# EAGLE design midi_switcher_trs (EAGLE 6.6.0)
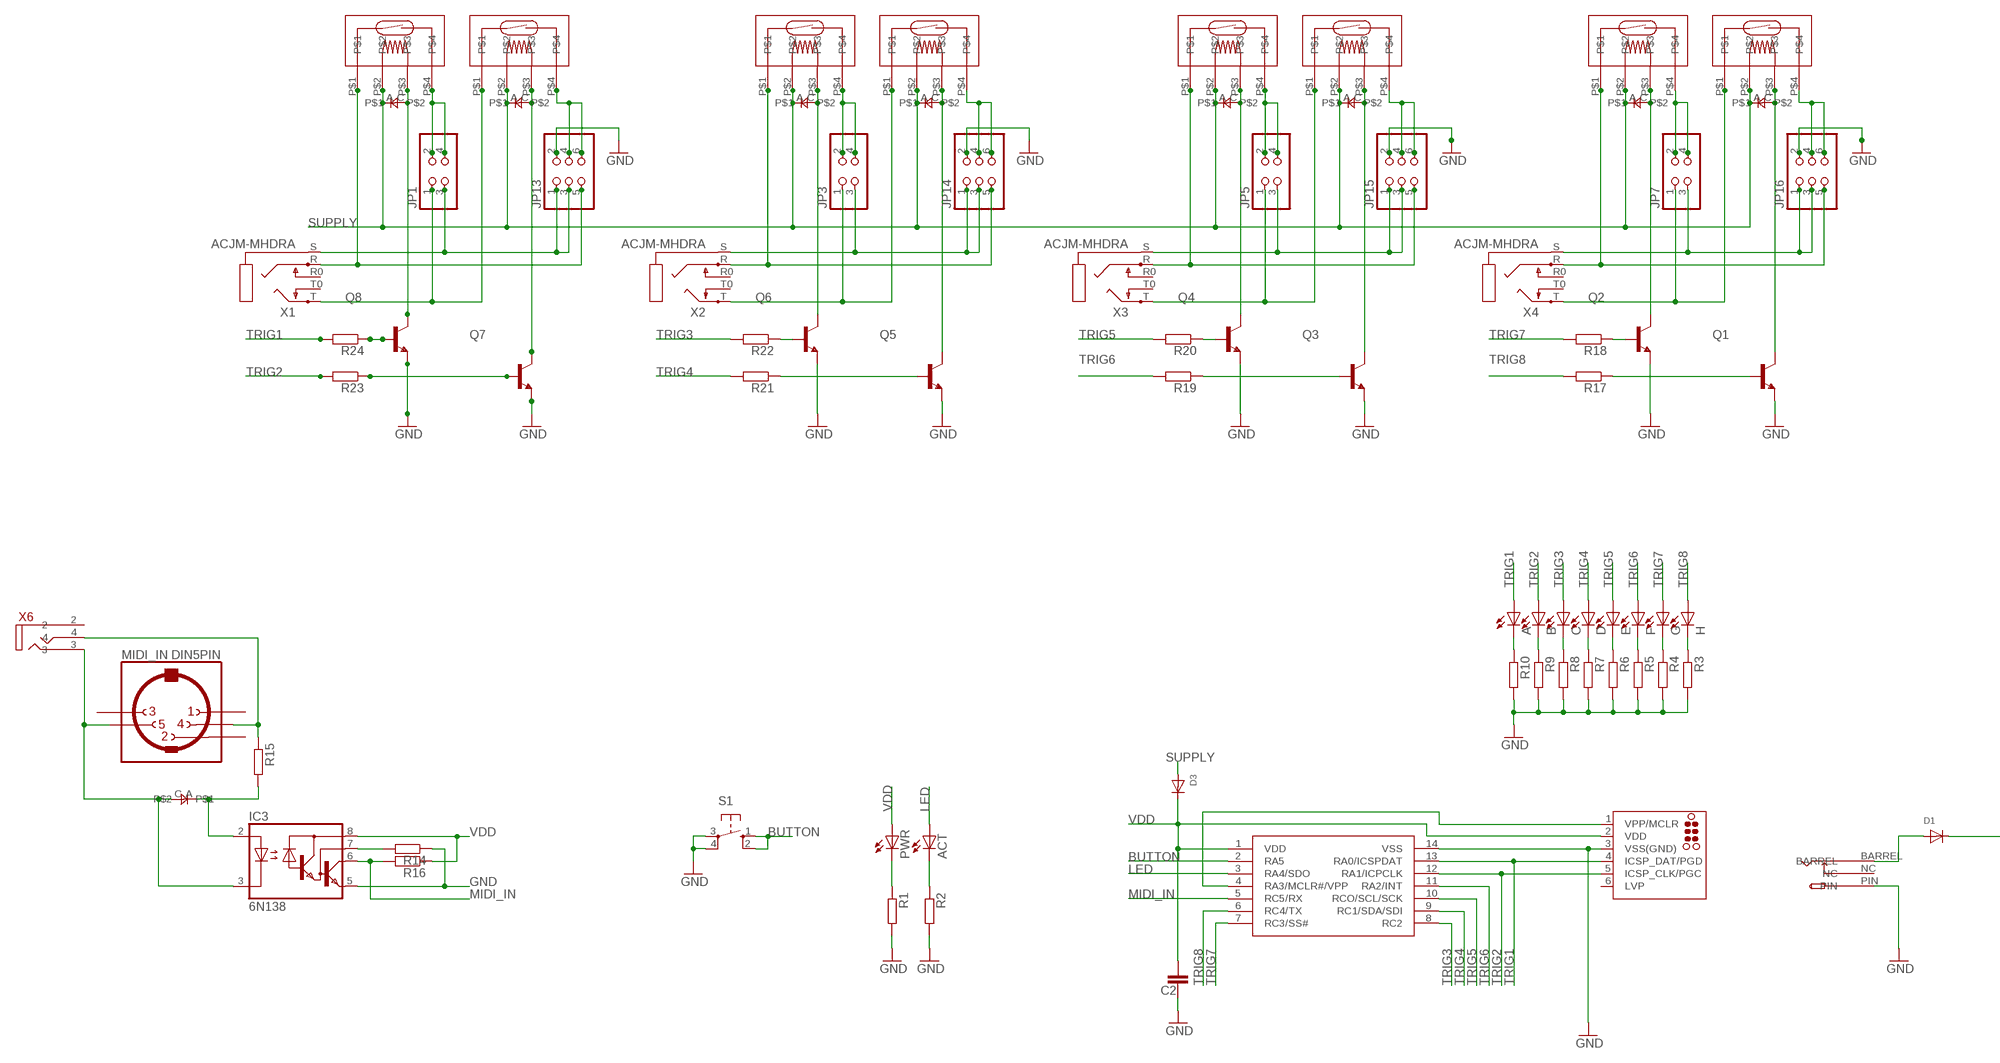
[diagram p0: schematic, sheet 1, part 1 of 2]
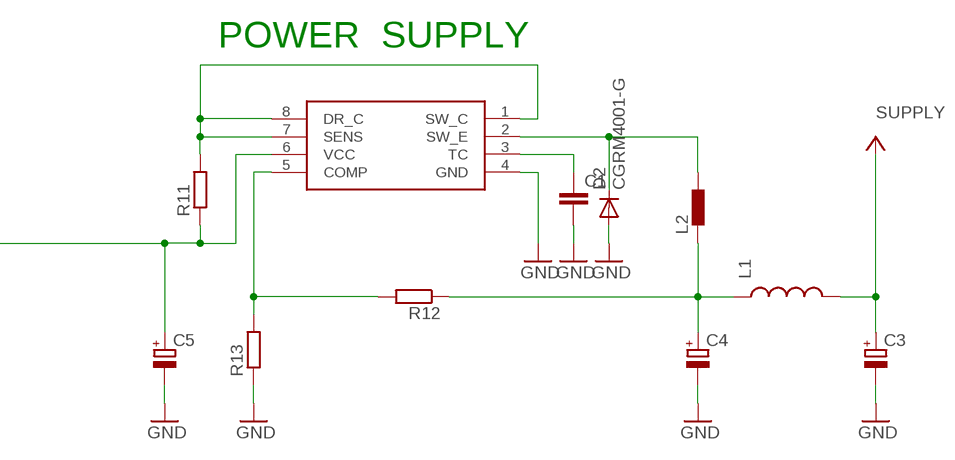
[diagram p1: schematic, sheet 1, part 2 of 2]

## Parts
A  LED3MM  [LED3MM]
ACT  LED3MM  [LED3MM]
B  LED3MM  [LED3MM]
C  LED3MM  [LED3MM]
C1  C-EUC0805  [C0805]
C2  C-EUC0805  [C0805]
C3  CPOL-EUE2.5-7  [E2,5-7]
C4  CPOL-EUE2.5-7  [E2,5-7]
C5  CPOL-EUE2.5-7  [E2,5-7]
D  LED3MM  [LED3MM]
D1  DIODESOD-123  [SOD-123]
D2  CGRM4001-G  [SOD-123_MINI-SMA]
D3  DIODESOD-123  [SOD-123]
D4  0805DIODE  [0805DIODE]
D5  0805DIODE  [0805DIODE]
D6  0805DIODE  [0805DIODE]
D7  0805DIODE  [0805DIODE]
D8  0805DIODE  [0805DIODE]
D9  0805DIODE  [0805DIODE]
D10  0805DIODE  [0805DIODE]
D11  0805DIODE  [0805DIODE]
D12  0805DIODE  [0805DIODE]
E  LED3MM  [LED3MM]
F  LED3MM  [LED3MM]
G  LED3MM  [LED3MM]
H  LED3MM  [LED3MM]
IC1  SP34063A_BOOST_REG  [SOIC8]
IC2  PIC16F1825SO14  [SO14]
IC3  6N138  [DIL08]
ICSP  TC2030-MCP-NL  [TC2030-MCP-NL]
JP1  PINHD-2X2  [2X02]
JP3  PINHD-2X2  [2X02]
JP5  PINHD-2X2  [2X02]
JP7  PINHD-2X2  [2X02]
JP13  PINHD-2X3  [2X03]
JP14  PINHD-2X3  [2X03]
JP15  PINHD-2X3  [2X03]
JP16  PINHD-2X3  [2X03]
L1  INDUCTOR1210  [1210]
L2  DR1030  [DR1030]
MIDI_IN  DIN5PIN  [EDGEDIN]
PWR  LED3MM  [LED3MM]
Q1  MMBT3904LT1-NPN-SOT23-BEC  [SOT23-BEC]
Q2  MMBT3904LT1-NPN-SOT23-BEC  [SOT23-BEC]
Q3  MMBT3904LT1-NPN-SOT23-BEC  [SOT23-BEC]
Q4  MMBT3904LT1-NPN-SOT23-BEC  [SOT23-BEC]
Q5  MMBT3904LT1-NPN-SOT23-BEC  [SOT23-BEC]
Q6  MMBT3904LT1-NPN-SOT23-BEC  [SOT23-BEC]
Q7  MMBT3904LT1-NPN-SOT23-BEC  [SOT23-BEC]
Q8  MMBT3904LT1-NPN-SOT23-BEC  [SOT23-BEC]
R1  R-EU_R0805  [R0805]
R2  R-EU_R0805  [R0805]
R3  R-EU_R0805  [R0805]
R4  R-EU_R0805  [R0805]
R5  R-EU_R0805  [R0805]
R6  R-EU_R0805  [R0805]
R7  R-EU_R0805  [R0805]
R8  R-EU_R0805  [R0805]
R9  R-EU_R0805  [R0805]
R10  R-EU_R0805  [R0805]
R11  R-EU_R0805  [R0805]
R12  R-EU_R0805  [R0805]
R13  R-EU_R0805  [R0805]
R14  R-EU_R0805  [R0805]
R15  R-EU_R0805  [R0805]
R16  R-EU_R0805  [R0805]
R17  R-EU_R0805  [R0805]
R18  R-EU_R0805  [R0805]
R19  R-EU_R0805  [R0805]
R20  R-EU_R0805  [R0805]
R21  R-EU_R0805  [R0805]
R22  R-EU_R0805  [R0805]
R23  R-EU_R0805  [R0805]
R24  R-EU_R0805  [R0805]
RLY1  9007-REED-RELAY  [9007-REED-RELAY]
RLY2  9007-REED-RELAY  [9007-REED-RELAY]
RLY3  9007-REED-RELAY  [9007-REED-RELAY]
RLY4  9007-REED-RELAY  [9007-REED-RELAY]
RLY5  9007-REED-RELAY  [9007-REED-RELAY]
RLY6  9007-REED-RELAY  [9007-REED-RELAY]
RLY7  9007-REED-RELAY  [9007-REED-RELAY]
RLY8  9007-REED-RELAY  [9007-REED-RELAY]
S1  10-XX  [B3F-10XX]
U$9  PWR_SOCKET_2_1MM  [PWR_SOCKET_2_1MM]
X1  ACJM-MHDRA  [ACJM-MHDR]
X2  ACJM-MHDRA  [ACJM-MHDR]
X3  ACJM-MHDRA  [ACJM-MHDR]
X4  ACJM-MHDRA  [ACJM-MHDR]
X6  VERTICAL_3_5MM_SOCKET  [VERTICAL_3_5MM_SOCKET]

## Nets
+9V: C5.+ D1.C IC1.6(VCC) R11.1
BUTTON: IC2.2(RA5) S1.1(S) S1.2(S1)
GND: C1.2 C2.2 C3.- C4.- C5.- D2.A IC1.4(GND) IC2.14(VSS) IC3.5(GND) ICSP.3(VSS(GND)) JP13.2 JP14.2 JP15.2 JP16.2 Q1.E Q2.E Q3.E Q4.E Q5.E Q6.E Q7.E Q8.E R1.2 R2.2 R3.2 R4.2 R5.2 R6.2 R7.2 R8.2 R9.2 R10.2 R13.1 R14.1 S1.3(P) S1.4(P1) U$9.PIN
LED: ACT.A IC2.3(RA4/SDO)
MIDI_IN: IC2.5(RC5/RX) IC3.6(VO) R16.2
N$1: JP1.2 JP1.4 RLY1.P$4
N$2: JP13.4 JP13.6 RLY2.P$4
N$3: JP13.5 RLY1.P$1 X1.R
N$4: JP1.1 RLY2.P$1 X1.T
N$5: JP1.3 JP13.1 JP13.3 X1.S
N$6: D11.C Q7.C RLY2.P$3
N$7: Q8.B R24.1
N$8: Q7.B R23.1
N$9: JP3.2 JP3.4 RLY3.P$4
N$10: D12.C Q8.C RLY1.P$3
N$11: JP14.4 JP14.6 RLY4.P$4
N$12: JP14.5 RLY3.P$1 X2.R
N$13: JP3.1 RLY4.P$1 X2.T
N$14: JP3.3 JP14.1 JP14.3 X2.S
N$15: D10.C Q6.C RLY3.P$3
N$16: D9.C Q5.C RLY4.P$3
N$17: Q6.B R22.1
N$18: Q5.B R21.1
N$19: JP5.2 JP5.4 RLY5.P$4
N$20: JP15.4 JP15.6 RLY6.P$4
N$21: JP15.5 RLY5.P$1 X3.R
N$22: JP5.1 RLY6.P$1 X3.T
N$23: JP5.3 JP15.1 JP15.3 X3.S
N$24: D8.C Q4.C RLY5.P$3
N$25: D7.C Q3.C RLY6.P$3
N$26: Q4.B R20.1
N$27: Q3.B R19.1
N$28: JP16.4 JP16.6 RLY8.P$4
N$29: JP7.2 JP7.4 RLY7.P$4
N$30: JP16.5 RLY7.P$1 X4.R
N$31: JP7.1 RLY8.P$1 X4.T
N$32: JP7.3 JP16.1 JP16.3 X4.S
N$33: D6.C Q2.C RLY7.P$3
N$34: D5.C Q1.C RLY8.P$3
N$35: Q2.B R18.1
N$36: Q1.B R17.1
N$37: D4.C IC3.3(C) MIDI_IN.5 X6.3
N$38: MIDI_IN.4 R15.1 X6.4
N$39: D4.A IC3.2(A) R15.2
N$40: IC3.7(VB) R14.2
N$41: PWR.K(C) R1.1
N$42: D1.A U$9.BARREL
N$44: IC1.1(SW_C) IC1.7(SENS) IC1.8(DR_C) R11.2
N$45: C1.1 IC1.3(TC)
N$46: D2.C IC1.2(SW_E) L2.2
N$47: IC1.5(COMP) R12.2 R13.2
N$48: ACT.K(C) R2.1
N$49: A.K(C) R10.1
N$50: B.K(C) R9.1
N$51: C.K(C) R8.1
N$52: D.K(C) R7.1
N$53: E.K(C) R6.1
N$54: F.K(C) R5.1
N$55: G.K(C) R4.1
N$56: H.K(C) R3.1
N$57: C4.+ L1.1 L2.1 R12.1
SUPPLY: C3.+ D3.A D5.A D6.A D7.A D8.A D9.A D10.A D11.A D12.A L1.2 RLY1.P$2 RLY2.P$2 RLY3.P$2 RLY4.P$2 RLY5.P$2 RLY6.P$2 RLY7.P$2 RLY8.P$2 ; supply symbol labelled +5V
TRIG1: A.A IC2.13(RA0/ICSPDAT) ICSP.4(ICSP_DAT/PGD) R24.2
TRIG2: B.A IC2.12(RA1/ICPCLK) ICSP.5(ICSP_CLK/PGC) R23.2
TRIG3: C.A IC2.8(RC2) R22.2
TRIG4: D.A IC2.9(RC1/SDA/SDI) R21.2
TRIG5: E.A IC2.10(RCO/SCL/SCK) R20.2
TRIG6: F.A IC2.11(RA2/INT) R19.2
TRIG7: G.A IC2.7(RC3/SS#) R18.2
TRIG8: H.A IC2.6(RC4/TX) R17.2
VDD: C2.1 D3.C IC2.1(VDD) IC3.8(VCC) ICSP.2(VDD) PWR.A R16.1
VPP: IC2.4(RA3/MCLR#/VPP) ICSP.1(VPP/MCLR)
Unconnected: ICSP.6(LVP) MIDI_IN.1 MIDI_IN.2 MIDI_IN.3 U$9.NC X1.R0 X1.T0 X2.R0 X2.T0 X3.R0 X3.T0 X4.R0 X4.T0 X6.2

## Notes on the sheet
- POWER  SUPPLY

## Library data of the parts
A ACT B C D E F G H PWR = led:LED: LED OSRAM: - CHIPLED LG R971, LG N971, LY N971, LG Q971, LY Q971, LO R971, LY R971 LH N974, LH R974 LS Q976, LO Q976, LY Q976 LO Q996 - Hyper CHIPLED LW Q18S LB Q993, LB Q99A, LB R99A - SideLED LS A670, LO A670, LY A670, LG A670, LP A670 LB A673, LV A673, LT A673, LW A673 LH A674 LY A675 LS A676, LA A676, LO A676, LY A676, LW A676 LS A679, LY A679, LG A679 - Hyper Micro SIDELED® LS Y876, LA Y876, LO Y876, LY Y876 LT Y87S - SmartLED LW L88C, LW L88S LB L89C, LB L89S, LG L890 LS L89K, LO L89K, LY L89K LS L896, LA L896, LO L896, LY L896 - TOPLED LS T670, LO T670, LY T670, LG T670, LP T670 LSG T670, LSP T670, LSY T670, LOP T670, LYG T670 LG T671, LOG T671, LSG T671 LB T673, LV T673, LT T673, LW T673 LH T674 LS T676, LA T676, LO T676, LY T676, LB T676, LH T676, LSB T676, LW T676 LB T67C, LV T67C, LT T67C, LS T67K, LO T67K, LY T67K, LW E67C LS E67B, LA E67B, LO E67B, LY E67B, LB E67C, LV E67C, LT E67C LW T67C LS T679, LY T679, LG T679 LS T770, LO T770, LY T770, LG T770, LP T770 LB T773, LV T773, LT T773, LW T773 LH T774 LS E675, LA E675, LY E675, LS T675 LS T776, LA T776, LO T776, LY T776, LB T776 LHGB T686 LT T68C, LB T68C - Hyper Mini TOPLED® LB M676 - Mini TOPLED Santana® LG M470 LS M47K, LO M47K, LY M47K Source: http://www.osram.convergy.de LUXEON: - LUMILED® LXK2-PW12-R00, LXK2-PW12-S00, LXK2-PW14-U00, LXK2-PW14-V00 LXK2-PM12-R00, LXK2-PM12-S00, LXK2-PM14-U00 LXK2-PE12-Q00, LXK2-PE12-R00, LXK2-PE12-S00, LXK2-PE14-T00, LXK2-PE14-U00 LXK2-PB12-K00, LXK2-PB12-L00, LXK2-PB12-M00, LXK2-PB14-N00, LXK2-PB14-P00, LXK2-PB14-Q00 LXK2-PR12-L00, LXK2-PR12-M00, LXK2-PR14-Q00, LXK2-PR14-R00 LXK2-PD12-Q00, LXK2-PD12-R00, LXK2-PD12-S00 LXK2-PH12-R00, LXK2-PH12-S00 LXK2-PL12-P00, LXK2-PL12-Q00, LXK2-PL12-R00 Source: www.luxeon.com KINGBRIGHT: KA-3528ASYC Source: www.kingbright.com
C1 C2 = rcl:C-EU: CAPACITOR, European symbol
C3-C5 = rcl:CPOL-EU: POLARIZED CAPACITOR, European symbol
D1 D3 = microbuilder:DIODE: Diode SMADIODE - SMA Surface Mount Package 20V 1A Schottky Diode Digikey (500mV @ 1A, 500uA Vr @ 20V): 641-1014-6-ND 10V 2A Schottky Diode Digikey (350mV @ 2A, 700uA Vr @ 10V): MBRA210LT3 SOD-123 30V 200mA (800mV Vf, 2uA Vr @ 25V) Schottky Diode (very fast switching for boost, etc.) - Digikey: BAT54T1GOSTR-ND 30V 500mA (430mV Vf, 130uA Vr @ 30V) Schottky Diode - Digikey: B0530W-FDICT-ND MBR120 1A 20V (0.34Vf) Schottky Diode - Digikey: MBR120VLSFT1GOSCT-ND SOD-323 10V 570mA (380mV Vf, 3ns) Schottky Diode - Digikey: ZLLS410CT-ND 1N4148WS - 75V 150mA (1V Vf @ 10mA, 4ns) Simple Diode - Digikey: 1N4148WSFSCT-ND, Mouser: 512-1N4148WS SOD-523 BAT54 30V 200mA Schottky (0.8 Vf @ 100mA, 5ns) - Digikey: BAT54XV2CT-ND 30V 30mA Schottky Diode (RB751S-40TE61) - Digikey: RB751S-40TE61CT-ND SOT23-R/W - SOT23 Package (R = Solder Paste/Reflow Ovens, W = Hand-Soldering) BAT54Film 40V 300mA - Digikey: 497-7162-1-ND DO-1N4148 Through Hole Small Current Diode (any model)
D2 = diode:CGRM400*-G: Molded plasitc,JEDEC SOD-123/Mini SMA Source: Comchip CGRM4001-G.pdf
D4-D12 = jasons_stuff:0805DIODE
IC1 = jason_eagle6:SP34063A_BOOST_REG
IC2 = jasons_stuff:PIC16F1825
IC3 = optocoupler:6N138: MOTOROLA OPTO COUPLER; MF: VISHAY/TELEFUNKEN; MPN: 6N138; OC_FARNELL: 9860150; OC_NEWARK: 35K5294
ICSP = tag-connect:TC2030: TAG-CONNECT ICSP Connector Manufacturer: Tag-Connect <http://www.tag-connect.com> Cable for easy In-Circuit Serial Programming. Designed for Microchip ICD2, suitable for many others. Two variants - one "with legs" (for hands-free fit on PCB) and another "without legs" for quick programming. PAD Description 1 MCLR/Vpp 2 Vdd 3 GND 4 PGD (ISPDAT) 5 PGC (ISPCLK) 6 nc (used for LVP) ©2009 ROFA.cz - modified and updated by Robert Darlington ‹rdarlington@gmail.com›
JP1 JP3 JP5 JP7 = pinhead:PINHD-2X2: PIN HEADER
JP13-JP16 = pinhead:PINHD-2X3: PIN HEADER
L1 = SparkFun:INDUCTOR: Inductors Basic Inductor/Choke - 0603 and 1206. Footprints are not proven and vary greatly between part numbers.
L2 = inductors:DR1030: DR1030 Series Low Profile Power Inductors Source: Data sheet <http://www.cooperbussmann.com/pdf/c73e479f-f867-4c64-ae26-9c1f23814163.pdf>
MIDI_IN = jason_eagle6:DIN5PIN: Female CONNECTOR 5 pins 90 deg. with shield, horizontal (DIN 41524)
Q1-Q8 = transistor:*-NPN-: NPN Transistror BF959 corrected 2008.03.06
R1-R24 = rcl:R-EU_: RESISTOR, European symbol
RLY1-RLY8 = jason_eagle6:9007-REED-RELAY
S1 = switch-omron:10-XX: OMRON SWITCH; MPN: B3F-1000; OC_FARNELL: 176432; OC_NEWARK: 36M3542
U$9 = jason_eagle6:PWR_SOCKET_2_1MM
X1-X4 = jason_eagle6:ACJM-MHDRA: MIC/HEADPHONE JACK Stereo jack with two switches. Kycon STX3100, CUI SJ1-3555NG and/or 4UCon 05544
X6 = jason_eagle6:VERTICAL_3_5MM_SOCKET

## Board
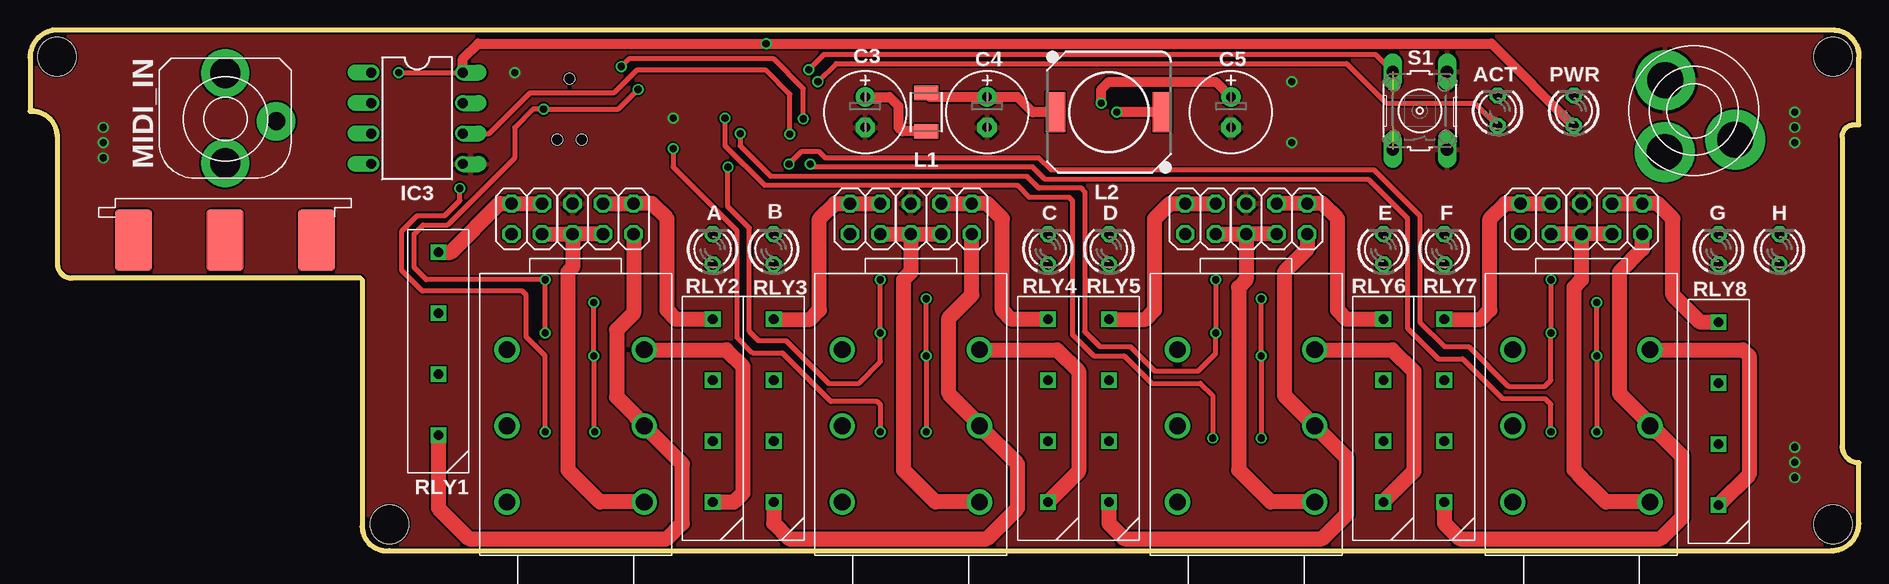
[diagram p2: board, top side]
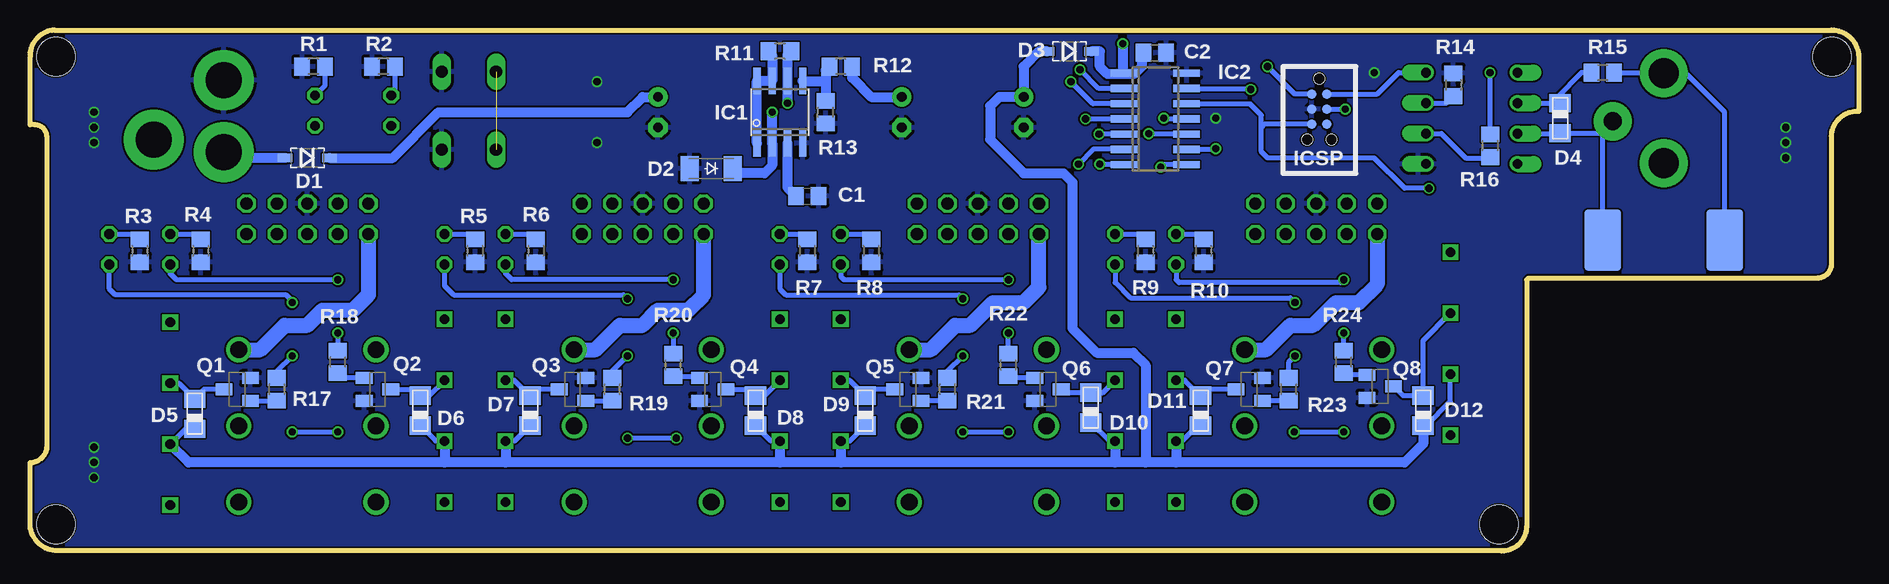
[diagram p3: board, bottom side, seen from below]

Size 152.4 x 43.45 mm. Coordinates in mm from the lower left corner, seen from the top.
Outline: 27.56,22.75 3.48,22.75
Outline: 3.48,22.75 3.43,22.75
Outline: 27.69,22.62 27.69,2.05 arc97 29.97,0.01 150.11,0.01 arc90 152.4,2.3 152.4,7.35 arc-90 151,8.75 151,34.53
Outline: 151,34.56 151,34.53
Outline: 2.29,34.56 2.29,34.53
Outline: 2.29,34.53 2.29,23.94 arc90 3.48,22.75
Outline: 2.29,34.53 arc90 0.15,36.67 0,36.67 0,41.16 arc-90 2.29,43.45 150.37,43.45 arc-90 152.4,41.16 152.4,35.55 152.02,35.55 arc90 151,34.53
Copper layers (1*16): Top 0.035mm / dielectric 1.5mm / Bottom 0.035mm
Design rules "hackvana": minimum track width 6mil, minimum drill 0.3mm, track to track 6mil, track to pad 9mil, pad to pad 6mil, via to via 6mil, smd to smd 0mil, copper to edge 6mil, drill to drill 6mil, minimum pad ring 10mil, minimum via ring 6mil, stop-mask expansion 2mil, vias tented up to drill 100mil, thermal gap 10mil
Holes 3.2 mm at 2.25,41.22 29.97,2.22 150.25,41.22 150.25,2.22

### Footprints (pad centres in the part's own frame; a part is rotated, then mirrored left to right if it is on the bottom)
LED3MM = drill 0.813 octagon: A -1.27,0; K 1.27,0
C0805 = smd 1.3 x 1.5: 1 -0.95,0; 2 0.95,0
E2,5-7 = drill 0.813 pad 1.6: + -1.27,0 | drill 0.813 pad 1.6 octagon: - 1.27,0
SOD-123 = smd 1.2 x 0.7: A 1.85,0; C -1.85,0
SOD-123_MINI-SMA = smd 1.5 x 2.1: A 1.8,0; C -1.8,0
0805DIODE = smd 1.524 x 1.778: A -1.262,-0.005; C 1.238,-0.005
SOIC8 = smd 0.6 x 2.2: 1 -1.905,-2.6; 2 -0.635,-2.6; 3 0.635,-2.6; 4 1.905,-2.6; 5 1.905,2.6; 6 0.635,2.6; 7 -0.635,2.6; 8 -1.905,2.6
SO14 = smd 0.6 x 2.2: 1 -3.81,-2.6; 2 -2.54,-2.6; 3 -1.27,-2.6; 4 0,-2.6; 5 1.27,-2.6; 6 2.54,-2.6; 7 3.81,-2.6; 8 3.81,2.6; 9 2.54,2.6; 10 1.27,2.6; 11 0,2.6; 12 -1.27,2.6; 13 -2.54,2.6; 14 -3.81,2.6
DIL08 = drill 0.813 offset: 1 -3.81,-3.81; 2 -1.27,-3.81; 3 1.27,-3.81; 4 3.81,-3.81; 5 3.81,3.81; 6 1.27,3.81; 7 -1.27,3.81; 8 -3.81,3.81
TC2030-MCP-NL = smd 0.787 x 0.787: 1 1.27,-0.635; 2 1.27,0.635; 3 2.54,-0.635; 4 2.54,0.635; 5 3.81,-0.635; 6 3.81,0.635 | hole 0.889: 0,0; 5.08,-1.016; 5.08,1.016
2X02 = drill 1.016 octagon: 1 -1.27,-1.27; 2 -1.27,1.27; 3 1.27,-1.27; 4 1.27,1.27
2X03 = drill 1.016 octagon: 1 -2.54,-1.27; 2 -2.54,1.27; 3 0,-1.27; 4 0,1.27; 5 2.54,-1.27; 6 2.54,1.27
1210 = smd 1.2 x 2: 1 -1.6,0; 2 1.6,0
DR1030 = smd 3.3 x 1.6: 1 0,4.45; 2 0,-4.45
EDGEDIN = smd 3.048 x 5.08: 1 -7.62,-10.16; 2 0,-10.16; 3 7.62,-10.16 | smd 3.048 x 5.08 bottom: 4 -5.08,-10.16; 5 5.08,-10.16
SOT23-BEC = smd 1 x 1.4: B -0.95,-1.1; C 0,1.1; E 0.95,-1.1
R0805 = smd 1.3 x 1.5: 1 -0.95,0; 2 0.95,0
9007-REED-RELAY = drill 0.8 square: P$1 0,7.62; P$2 0,2.54; P$3 0,-2.54; P$4 0,-7.62
B3F-10XX = drill 1.016 long: 1 -3.251,2.261; 2 3.251,2.261; 3 -3.251,-2.261; 4 3.251,-2.261
PWR_SOCKET_2_1MM = drill 3 pad 5: BARREL 0,4.2; NC -4.2,0; PIN 3.4,-0.7
ACJM-MHDR = drill 1.397: R 0,5.715; R0 0,-5.715; S 6.35,5.715; S0 6.35,-5.715; T -6.35,5.715; T0 -6.35,-5.715
VERTICAL_3_5MM_SOCKET = drill 2.5 pad 4: 2 0,-3.75; 4 0,3.75 | drill 1.5 pad 3.2: 3 4.25,-0.25

### Placement (x,y rotation side)
A  56.9,25.16 90 top
ACT  122.3,36.72 90 top
B  61.98,25.16 90 top
C  84.84,25.16 90 top
C1  87.63,29.6 0 bottom
C2  58.67,41.54 0 bottom
C3  69.6,36.59 270 top
C4  79.76,36.59 270 top
C5  100.08,36.59 270 top
D  89.92,25.16 90 top
D1  129.29,32.78 180 bottom
D2  95.63,31.89 180 bottom
D3  65.79,41.67 180 bottom
D4  24.89,36.08 270 bottom
D5  138.68,11.44 90 bottom
D6  119.89,11.7 90 bottom
D7  110.74,11.7 90 bottom
D8  91.95,11.7 90 bottom
D9  82.8,11.7 90 bottom
D10  64.01,11.95 90 bottom
D11  54.86,11.7 90 bottom
D12  36.32,11.7 90 bottom
E  112.78,25.16 90 top
F  117.86,25.16 90 top
G  140.72,25.16 90 top
H  145.8,25.16 90 top
IC1  89.92,36.59 0 bottom
IC2  58.62,36.03 270 bottom
IC3  32.26,36.08 270 top
ICSP  44.96,39.38 270 bottom
JP1  41.4,27.7 0 top
JP3  69.6,27.7 0 top
JP5  97.54,27.7 0 top
JP7  125.48,27.7 0 top
JP13  47.75,27.7 0 top
JP14  75.95,27.7 0 top
JP15  103.89,27.7 0 top
JP16  131.83,27.7 0 top
L1  74.68,36.59 270 top
L2  89.92,36.59 90 top
MIDI_IN  16.26,36.08 0 top
PWR  128.65,36.72 90 top
Q1  135.13,13.48 90 bottom
Q2  123.44,13.48 270 bottom
Q3  107.19,13.48 90 bottom
Q4  95.5,13.48 270 bottom
Q5  79.25,13.48 90 bottom
Q6  67.56,13.48 270 bottom
Q7  50.8,13.48 90 bottom
Q8  39.88,13.73 270 bottom
R1  128.78,40.4 180 bottom
R2  122.94,40.4 180 bottom
R3  143.26,25.03 270 bottom
R4  138.18,25.03 270 bottom
R5  115.32,25.03 270 bottom
R6  110.24,25.03 270 bottom
R7  87.63,25.03 270 bottom
R8  82.3,25.03 270 bottom
R9  59.44,25.03 270 bottom
R10  54.61,25.03 270 bottom
R11  89.92,41.67 180 bottom
R12  84.84,40.4 180 bottom
R13  86.11,36.59 90 bottom
R14  33.78,38.88 270 bottom
R15  21.34,39.89 180 bottom
R16  30.73,33.8 270 bottom
R17  131.83,13.48 90 bottom
R18  126.75,15.76 90 bottom
R19  103.89,13.48 90 bottom
R20  98.81,15.51 90 bottom
R21  75.95,13.48 90 bottom
R22  70.87,15.51 90 bottom
R23  47.5,13.48 90 bottom
R24  42.93,15.76 90 bottom
RLY1  34.04,17.29 180 top
RLY2  56.9,11.7 180 top
RLY3  61.98,11.7 180 top
RLY4  84.84,11.7 180 top
RLY5  89.92,11.7 180 top
RLY6  112.78,11.7 180 top
RLY7  117.86,11.7 180 top
RLY8  140.72,11.44 180 top
S1  115.82,36.72 90 top
U$9  138.65,36.72 145 top
X1  45.47,10.43 270 top
X2  73.41,10.43 270 top
X3  101.35,10.43 270 top
X4  129.29,10.43 270 top
X6  16.26,36.08 0 top

### Tracks (layer width: path | path; a pad name or v marks a point on that pad's centre or on a via)
+9V  (via drill 0.6)
  Top 0.813: v89.28,37.35 89.28,38.49 89.92,39.13 98.81,39.13 C5.+
  Bottom 0.406: 89.28,41.35 R11.1
  Bottom 0.813: v89.28,37.35 IC1.6 89.28,41.35 | D1.C 122.17,32.78 118.36,36.59 102.62,36.59 101.35,37.86 C5.+
BUTTON  (via drill 0.6)  (1 unrouted)
  Top 0.406: v64.9,40.15 66.17,41.42 112.12,41.42 S1.2
  Bottom 0.406: IC2.2 63.32,38.57 v64.9,40.15
GND  (via drill 0.6)
  other vias: 147.07,7.38 147.07,8.65 147.07,6.11 147.07,36.59 147.07,35.32 147.07,34.05 105.16,39.13 105.16,34.05 6.1,35.32 6.1,34.05 6.1,32.78 53.59,36.08 40.39,39.89
  pour Bottom: -5.33,50.56 -5.33,-4.05 157.23,-4.05 157.23,54.37 -5.33,54.37
  pour Top: -7.87,48.02 -7.87,-6.59 158.5,-6.59 158.5,53.1 -7.87,53.1
LED  (via drill 0.6)
  Top 0.406: v65.66,39.13 67.18,40.65 109.73,40.65 113.03,37.35 120.4,37.35 ACT.A
  Bottom 0.406: IC2.3 63.83,37.3 v65.66,39.13
MIDI_IN  (via drill 0.6)
  Top 0.406: IC3.6 38.29,34.81 41.66,38.18 48.64,38.18 50.55,40.08 61.34,40.08 63.32,38.1 v63.32,34.76
  Bottom 0.406: IC3.6 34.8,34.81 32.77,32.78 30.8,32.78 R16.2 | IC2.5 v63.32,34.76
N$1
  Top 1.27: RLY1.P$4 35.05,24.91 39.12,28.97 JP1.2 JP1.4
N$2
  Top 1.27: JP13.4 JP13.6 | 50.55,28.97 JP13.6 | RLY2.P$4 53.85,19.32 53.09,20.08 53.09,27.7 51.82,28.97 JP13.6
N$3
  Top 1.27: RLY1.P$1 34.04,3.57 36.58,1.03 53.09,1.03 54.36,2.3 54.36,7.25 51.75,9.86 X1.R | X1.R 51.18,10.55 | JP13.5 50.29,19.83 48.9,18.43 48.9,12.84 50.55,11.19 50.55,11.06 X1.R
N$4
  Top 1.27: RLY2.P$1 58.67,4.08 59.44,4.84 59.44,15.38 58.04,16.78 X1.T
  Bottom 1.27: X1.T 49.4,16.78 47.37,18.81 45.47,18.81 43.56,20.71 41.66,20.71 40.13,22.24 JP1.1
N$5
  Top 1.27: X1.S 47.5,4.08 44.83,6.74 44.83,23.25 45.21,23.64 JP13.1 | JP1.3 JP13.1 | JP13.3 JP13.1
N$6
  Bottom 0.406: Q7.C 54.32,13.48 D11.C 56.16,14.24 RLY2.P$3
N$7
  Bottom 0.406: Q8.B 42.79,14.68 R24.1
N$8
  Bottom 0.406: R23.1 Q7.B
N$9
  Top 1.27: RLY3.P$4 65.02,19.32 65.79,20.08 65.79,27.7 67.06,28.97 JP3.2 JP3.4
N$10
  Bottom 0.406: Q8.C 37.98,12.94 D12.C 36.32,17.54 RLY1.P$3
N$11
  Top 1.27: RLY4.P$4 81.79,19.32 81.03,20.08 81.03,27.7 79.76,28.97 JP14.6 JP14.4
N$12
  Top 1.27: RLY3.P$1 61.98,2.3 63.25,1.03 79.76,1.03 82.3,3.57 82.3,7.25 X2.R 79.12,10.55 76.58,13.09 76.58,19.44 78.49,21.35 JP14.5 78.49,25.16
N$13
  Top 1.27: X2.T 85.6,16.78 87.38,15 87.38,6.62 RLY4.P$1
  Bottom 1.27: X2.T 77.34,16.78 75.31,18.81 74.04,18.81 72.14,20.71 69.6,20.71 68.33,21.98 JP3.1
N$14
  Top 1.27: X2.S 75.44,4.08 72.77,6.74 72.77,22.62 73.41,23.25 JP14.1 | JP3.3 JP14.1 | JP14.1 JP14.3
N$15
  Bottom 0.406: RLY3.P$3 63.02,13.19 D10.C 66.18,13.19 Q6.C
N$16
  Bottom 0.406: Q5.C 82.26,13.48 D9.C 84.1,14.24 RLY4.P$3
N$17
  Bottom 0.406: Q6.B 70.73,14.43 R22.1
N$18
  Bottom 0.406: R21.1 Q5.B
N$19
  Top 1.27: RLY5.P$4 92.96,19.32 93.73,20.08 93.73,27.7 95,28.97 JP5.2 JP5.4
N$20
  Top 1.27: RLY6.P$4 109.73,19.32 108.97,20.08 108.97,27.7 107.7,28.97 JP15.6 JP15.4
N$21
  Top 1.27: RLY5.P$1 89.92,2.3 91.19,1.03 107.7,1.03 109.73,3.06 109.73,7.76 X3.R | X3.R 107.06,10.55 | JP15.5 106.43,25.16 104.52,23.25 104.52,12.97 X3.R
N$22
  Top 1.27: X3.T 113.54,16.78 115.32,15 115.32,6.62 RLY6.P$1
  Bottom 1.27: JP5.1 96.27,21.35 97.54,20.08 100.08,20.08 101.35,18.81 103.25,18.81 105.28,16.78 X3.T
N$23
  Top 1.27: X3.S 103.38,4.08 100.71,6.74 100.71,21.98 101.35,22.62 JP15.1 | JP5.3 JP15.1 | JP15.3 JP15.1
N$24
  Bottom 0.406: Q4.C 92.48,13.48 D8.C 91.22,12.94 RLY5.P$3
N$25
  Bottom 0.406: RLY6.P$3 112.04,14.24 D7.C 110.2,13.48 Q3.C
N$26
  Bottom 0.406: R20.1 96.74,14.56 Q4.B
N$27
  Bottom 0.406: Q3.B R19.1
N$28
  Top 1.27: JP16.4 JP16.6 135.64,28.97 136.91,27.7 136.91,21.35 139.19,19.06 RLY8.P$4
N$29
  Top 1.27: RLY7.P$4 120.9,19.32 121.67,20.08 121.67,27.7 122.94,28.97 JP7.2 JP7.4
N$30
  Top 1.27: RLY7.P$1 117.86,2.3 119.13,1.03 135.89,1.03 137.67,2.81 137.67,7.89 135.64,9.92 135.51,9.92 X4.R 135,10.55 132.46,13.09 132.46,23.25 134.37,25.16 JP16.5
N$31
  Top 1.27: X4.T 142.75,16.78 143.26,16.27 143.26,6.36 RLY8.P$1
  Bottom 1.27: JP7.1 124.21,21.35 125.48,20.08 128.02,20.08 129.29,18.81 131.19,18.81 133.22,16.78 X4.T
N$32
  Top 1.27: X4.S 131.32,4.08 129.92,5.47 129.29,6.11 128.65,6.74 128.65,21.98 129.29,22.62 JP16.1 | JP16.3 JP16.1 | JP16.1 JP7.3
N$33
  Bottom 0.406: RLY7.P$3 119.16,12.94 D6.C 120.42,13.48 Q2.C
N$34
  Bottom 0.406: Q1.C 137.89,13.48 D5.C 139.98,13.98 RLY8.P$3
N$35
  Bottom 0.406: Q2.B 126.36,14.43 R18.1
N$36
  Bottom 0.406: Q1.B R17.1
N$37
  Bottom 0.406: IC3.3 24.93,34.81 D4.C 21.49,34.84 21.34,35 | X6.3 21.18,35.16 21.34,35 | MIDI_IN.5 21.34,35
N$38
  Bottom 0.406: MIDI_IN.4 11.18,36.59 14.42,39.83 X6.4 20.33,39.83 R15.1
N$39
  Bottom 0.406: R15.2 23.11,39.89 25.15,37.86 25.15,37.59 D4.A 24.9,37.35 IC3.2
N$40
  Bottom 0.406: IC3.7 34.36,37.35 R14.2
N$41
  Bottom 0.406: R1.1 127.83,38.81 PWR.K
N$42
  Bottom 0.813: D1.A 135.75,32.78 U$9.BARREL
N$44
  Bottom 0.406: 90.55,41.35 R11.2
  Bottom 0.813: IC1.1 IC1.8 IC1.7 90.55,41.35
N$45
  Bottom 0.813: IC1.3 89.28,30.31 C1.1
N$46  (via drill 0.6)
  Top 0.813: L2.2 v90.55,36.59
  Bottom 0.813: v90.55,36.59 IC1.2 90.55,32.14 91.19,31.51 93.45,31.51 D2.C
N$47
  Bottom 0.406: 86.11,40.08 R12.2
  Bottom 0.813: 86.11,40.08 86.11,39.13 | 86.11,39.13 R13.2 | IC1.5 86.17,39.19 86.11,39.13
N$48
  Bottom 0.406: R2.1 121.99,38.3 ACT.K
N$49
  Bottom 0.406: A.K 55.06,26.43 R10.1
N$50
  Bottom 0.406: B.K 59.88,26.43 R9.1
N$51
  Bottom 0.406: C.K 82.3,26.43 R8.1
N$52
  Bottom 0.406: D.K 88.08,26.43 R7.1
N$53
  Bottom 0.406: E.K 110.68,26.43 R6.1
N$54
  Bottom 0.406: F.K 115.76,26.43 R5.1
N$55
  Bottom 0.406: G.K 138.62,26.43 R4.1
N$56
  Bottom 0.406: H.K 143.7,26.43 R3.1
N$57
  Top 0.813: L2.1 83.57,36.59 82.3,37.86 C4.+ 75.01,37.86 L1.1
  Bottom 0.813: R12.1 83.89,39.45 82.3,37.86 C4.+
SUPPLY
  Top 0.813: L1.2 72.72,34.99 72.39,35.32 72.39,37.1 71.63,37.86 C3.+
  Bottom 0.406: RLY2.P$2 56.39,9.16 55.63,9.92 55.38,9.92 D11.A | RLY3.P$2 62.47,9.16 D10.A | RLY4.P$2 84.08,9.16 D9.A | RLY5.P$2 90.66,9.16 D8.A | RLY6.P$2 112.02,9.16 D7.A | RLY7.P$2 118.6,9.16 D6.A | D12.A 36.06,10.44 34.04,12.46 RLY1.P$2 | D5.A 139.44,10.18 RLY8.P$2
  Bottom 0.813: D12.A 36.32,8.91 37.85,7.38 56.9,7.38 | 56.9,7.38 59.44,7.38 | 59.44,7.38 61.98,7.38 | 61.98,7.38 84.84,7.38 | 84.84,7.38 89.92,7.38 | 89.92,7.38 112.78,7.38 | 112.78,7.38 117.86,7.38 | 117.86,7.38 139.19,7.38 RLY8.P$2 | RLY7.P$2 117.86,7.38 | RLY6.P$2 112.78,7.38 | RLY5.P$2 89.92,7.38 | RLY4.P$2 84.84,7.38 | RLY3.P$2 61.98,7.38 | RLY2.P$2 56.9,7.38 | D3.A 68.33,41.67 69.6,40.4 C3.+ 71.63,37.86 72.39,37.1 72.39,34.3 69.6,31.51 66.29,31.51 65.53,30.75 65.53,18.56 63.5,16.52 60.45,16.52 59.44,15.51 59.44,7.38
TRIG1  (via drill 0.6)
  Top 0.406: v50.67,38.49 49.02,36.84 v42.8,36.84 41.91,36.84 40.39,35.32 40.39,32.78 34.8,27.19 32.77,27.19 32,26.43 32,23.64 33.02,22.62 v42.93,22.62 v42.93,18.17
  Bottom 0.406: ICSP.4 v42.8,36.84 | IC2.13 50.75,38.57 v50.67,38.49 | R24.2 v42.93,18.17 | A.A 56.9,22.62 56.64,22.37 43.18,22.37 v42.93,22.62
TRIG2  (via drill 0.6)
  Top 0.406: v46.99,20.71 v46.99,16.27 46.99,9.98 v47.05,9.92 | v42.93,9.92 42.93,16.27 41.34,17.86 41.34,21.35 41.02,21.67 32.7,21.67 30.99,23.38 30.99,26.68 32.26,27.95 34.54,27.95 35.81,29.22 v35.81,30.24
  Bottom 0.406: ICSP.5 49.53,35.57 49.78,35.32 | IC2.12 50.75,37.3 49.78,36.34 49.78,35.32 | R23.2 47.5,15.76 v46.99,16.27 | v35.81,30.24 37.85,30.24 40.39,32.78 49.28,32.78 49.78,33.29 49.78,35.32 | v47.05,9.92 v42.93,9.92 | B.A 61.98,22.37 60.71,21.1 47.37,21.1 v46.99,20.71
TRIG3  (via drill 0.6)
  Top 0.406: v70.87,22.62 v70.87,18.17 70.87,15.76 69.09,13.98 66.55,13.98 62.99,17.54 60.71,17.54 59.94,18.3 59.94,26.94 58.17,28.72 v58.17,32.02
  Bottom 0.406: R22.2 v70.87,18.17 | IC2.8 57.96,32.22 v58.17,32.02 | C.A 84.84,22.87 84.58,22.62 v70.87,22.62
TRIG4  (via drill 0.6)
  Top 0.406: v74.68,21.03 v74.68,16.27 v74.68,9.92 | v53.59,33.54 53.59,32.02 58.93,26.68 58.93,17.79 60.2,16.52 62.67,16.52 66.74,12.46 70.61,12.46 70.87,12.21 v70.87,9.92
  Bottom 0.406: R21.2 75.95,15 v74.68,16.27 | v74.68,21.03 74.99,21.35 89.41,21.35 89.92,21.86 D.A | v74.68,9.92 v70.87,9.92 | IC2.9 53.65,33.49 v53.59,33.54
TRIG5  (via drill 0.6)
  Top 0.406: v98.81,22.62 v98.81,18.17 R20.2 97.35,15 93.73,15 91.69,17.03 89.15,17.03 87.88,18.3 87.88,29.99 87.63,30.24 84.07,30.24 83.06,31.26 61.72,31.26 59.18,33.8 v59.18,34.81
  Bottom 0.406: v98.81,18.17 R20.2 | IC2.10 59.13,34.76 v59.18,34.81 | v98.81,22.62 112.27,22.62 112.78,23.13 E.A
TRIG6  (via drill 0.6)
  Top 0.406: v102.62,21.03 v102.62,16.27 v102.62,9.41 | v57.91,36.08 57.91,33.8 61.21,30.49 82.3,30.49 83.31,29.48 86.61,29.48 86.87,29.22 86.87,18.05 88.65,16.27 91.19,16.27 93.47,13.98 97.54,13.98 98.55,12.97 v98.55,9.41
  Bottom 0.406: R19.2 103.89,15 v102.62,16.27 | v102.62,9.41 v98.55,9.41 | IC2.11 57.86,36.03 v57.91,36.08 | F.A 117.86,22.11 117.09,21.35 102.93,21.35 v102.62,21.03
TRIG7  (via drill 0.6)
  Top 0.406: v126.75,22.62 v126.75,18.17 126.75,14.24 126.24,13.73 123.19,13.73 119.89,17.03 117.86,17.03 115.82,19.06 115.82,27.95 112.01,31.76 85.09,31.76 84.07,32.78 66.29,32.78 65.79,33.29 64.26,33.29 v63.25,32.27
  Bottom 0.406: v126.75,18.17 R18.2 | IC2.7 63.2,32.22 v63.25,32.27 | G.A 140.72,23.13 140.21,22.62 v126.75,22.62
TRIG8  (via drill 0.6)
  Top 0.406: v130.56,20.71 v130.56,16.27 v130.56,9.92 | v126.75,9.92 126.75,12.21 126.24,12.71 122.68,12.71 119.38,16.02 117.35,16.02 114.81,18.56 114.81,27.7 111.51,31 84.58,31 83.57,32.02 65.28,32.02 v65.02,32.27
  Bottom 0.406: R17.2 131.83,15 v130.56,16.27 | v130.56,9.92 v126.75,9.92 | IC2.6 63.8,33.49 v65.02,32.27 | v130.56,20.71 130.56,20.84 131.06,21.35 145.29,21.35 145.8,21.86 H.A
VDD  (via drill 0.6)
  Top 0.406: v30.73,39.89 35.56,39.89 36.07,40.4
  Top 0.813: IC3.8 36.07,40.4 36.07,41.03 37.34,42.3 v61.34,42.3 121.79,42.3 PWR.A
  Bottom 0.406: R16.1 v30.73,39.89 | ICSP.2 40.13,38.11 38.35,39.89 IC3.8 | IC2.1 60.78,39.84 60.71,39.76
  Bottom 0.813: C2.1 59.75,41.67 59.75,40.4 60.39,39.76 60.71,39.76 62.61,39.76 63.25,40.4 63.25,41.67 D3.C | v61.34,42.3 61.34,39.96 IC2.1
VPP  (via drill 0.6)
  Top 0.406: v49.28,40.4 49.91,41.03 61.98,41.03 64.44,38.57 v64.44,36.03
  Bottom 0.406: IC2.4 v64.44,36.03 | v49.28,40.4 46.99,38.11 ICSP.1

### Text on the board
tDocu: six4pix.com/switchertrs | RT | RS | SG | TS | TR | RT | RS | SG | TS | TR | RT | RS | SG | TS | TR | RT | RS | A/B | C/D | E/F | G/H | SG | TS | TR | hotchk155
bDocu: Sixty Four Pixels | MIDI SWITCHER TRS REV 2